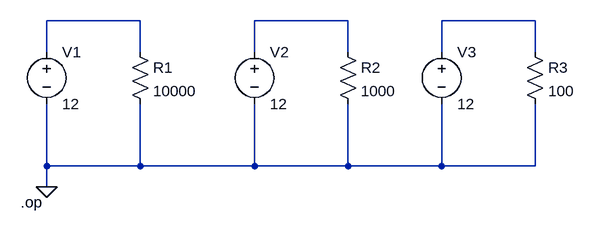
[diagram p0: schematic 2_The influence of resistance on current.asc]
2_The influence of resistance on current.asc, the LTspice schematic file:
Version 4.1
SHEET 1 1000 680
WIRE 272 80 128 80
WIRE 592 80 448 80
WIRE 880 80 736 80
WIRE 128 128 128 80
WIRE 272 128 272 80
WIRE 448 128 448 80
WIRE 592 128 592 80
WIRE 736 128 736 80
WIRE 880 128 880 80
WIRE 128 304 128 208
WIRE 272 304 272 208
WIRE 272 304 128 304
WIRE 448 304 448 208
WIRE 448 304 272 304
WIRE 592 304 592 208
WIRE 592 304 448 304
WIRE 736 304 736 208
WIRE 736 304 592 304
WIRE 880 304 880 208
WIRE 880 304 736 304
WIRE 128 336 128 304
FLAG 128 336 0
SYMBOL voltage 128 112 R0
WINDOW 123 0 0 Left 0
WINDOW 39 0 0 Left 0
SYMATTR InstName V1
SYMATTR Value 12
SYMBOL voltage 448 112 R0
WINDOW 123 0 0 Left 0
WINDOW 39 0 0 Left 0
SYMATTR InstName V2
SYMATTR Value 12
SYMBOL voltage 736 112 R0
WINDOW 123 0 0 Left 0
WINDOW 39 0 0 Left 0
SYMATTR InstName V3
SYMATTR Value 12
SYMBOL res 256 112 R0
SYMATTR InstName R1
SYMATTR Value 10000
SYMBOL res 576 112 R0
SYMATTR InstName R2
SYMATTR Value 1000
SYMBOL res 864 112 R0
SYMATTR InstName R3
SYMATTR Value 100
TEXT 88 360 Left 2 !.op

The netlist it stands for:
* 2_The influence of resistance on current.asc
V1 N001 0 12
V2 N002 0 12
V3 N003 0 12
R1 N001 0 10000
R2 N002 0 1000
R3 N003 0 100
.op
.backanno
.end